# Altium schematic sheet Schematic.SchDoc
size A2; SheetNumber: 1; SheetTotal: 1
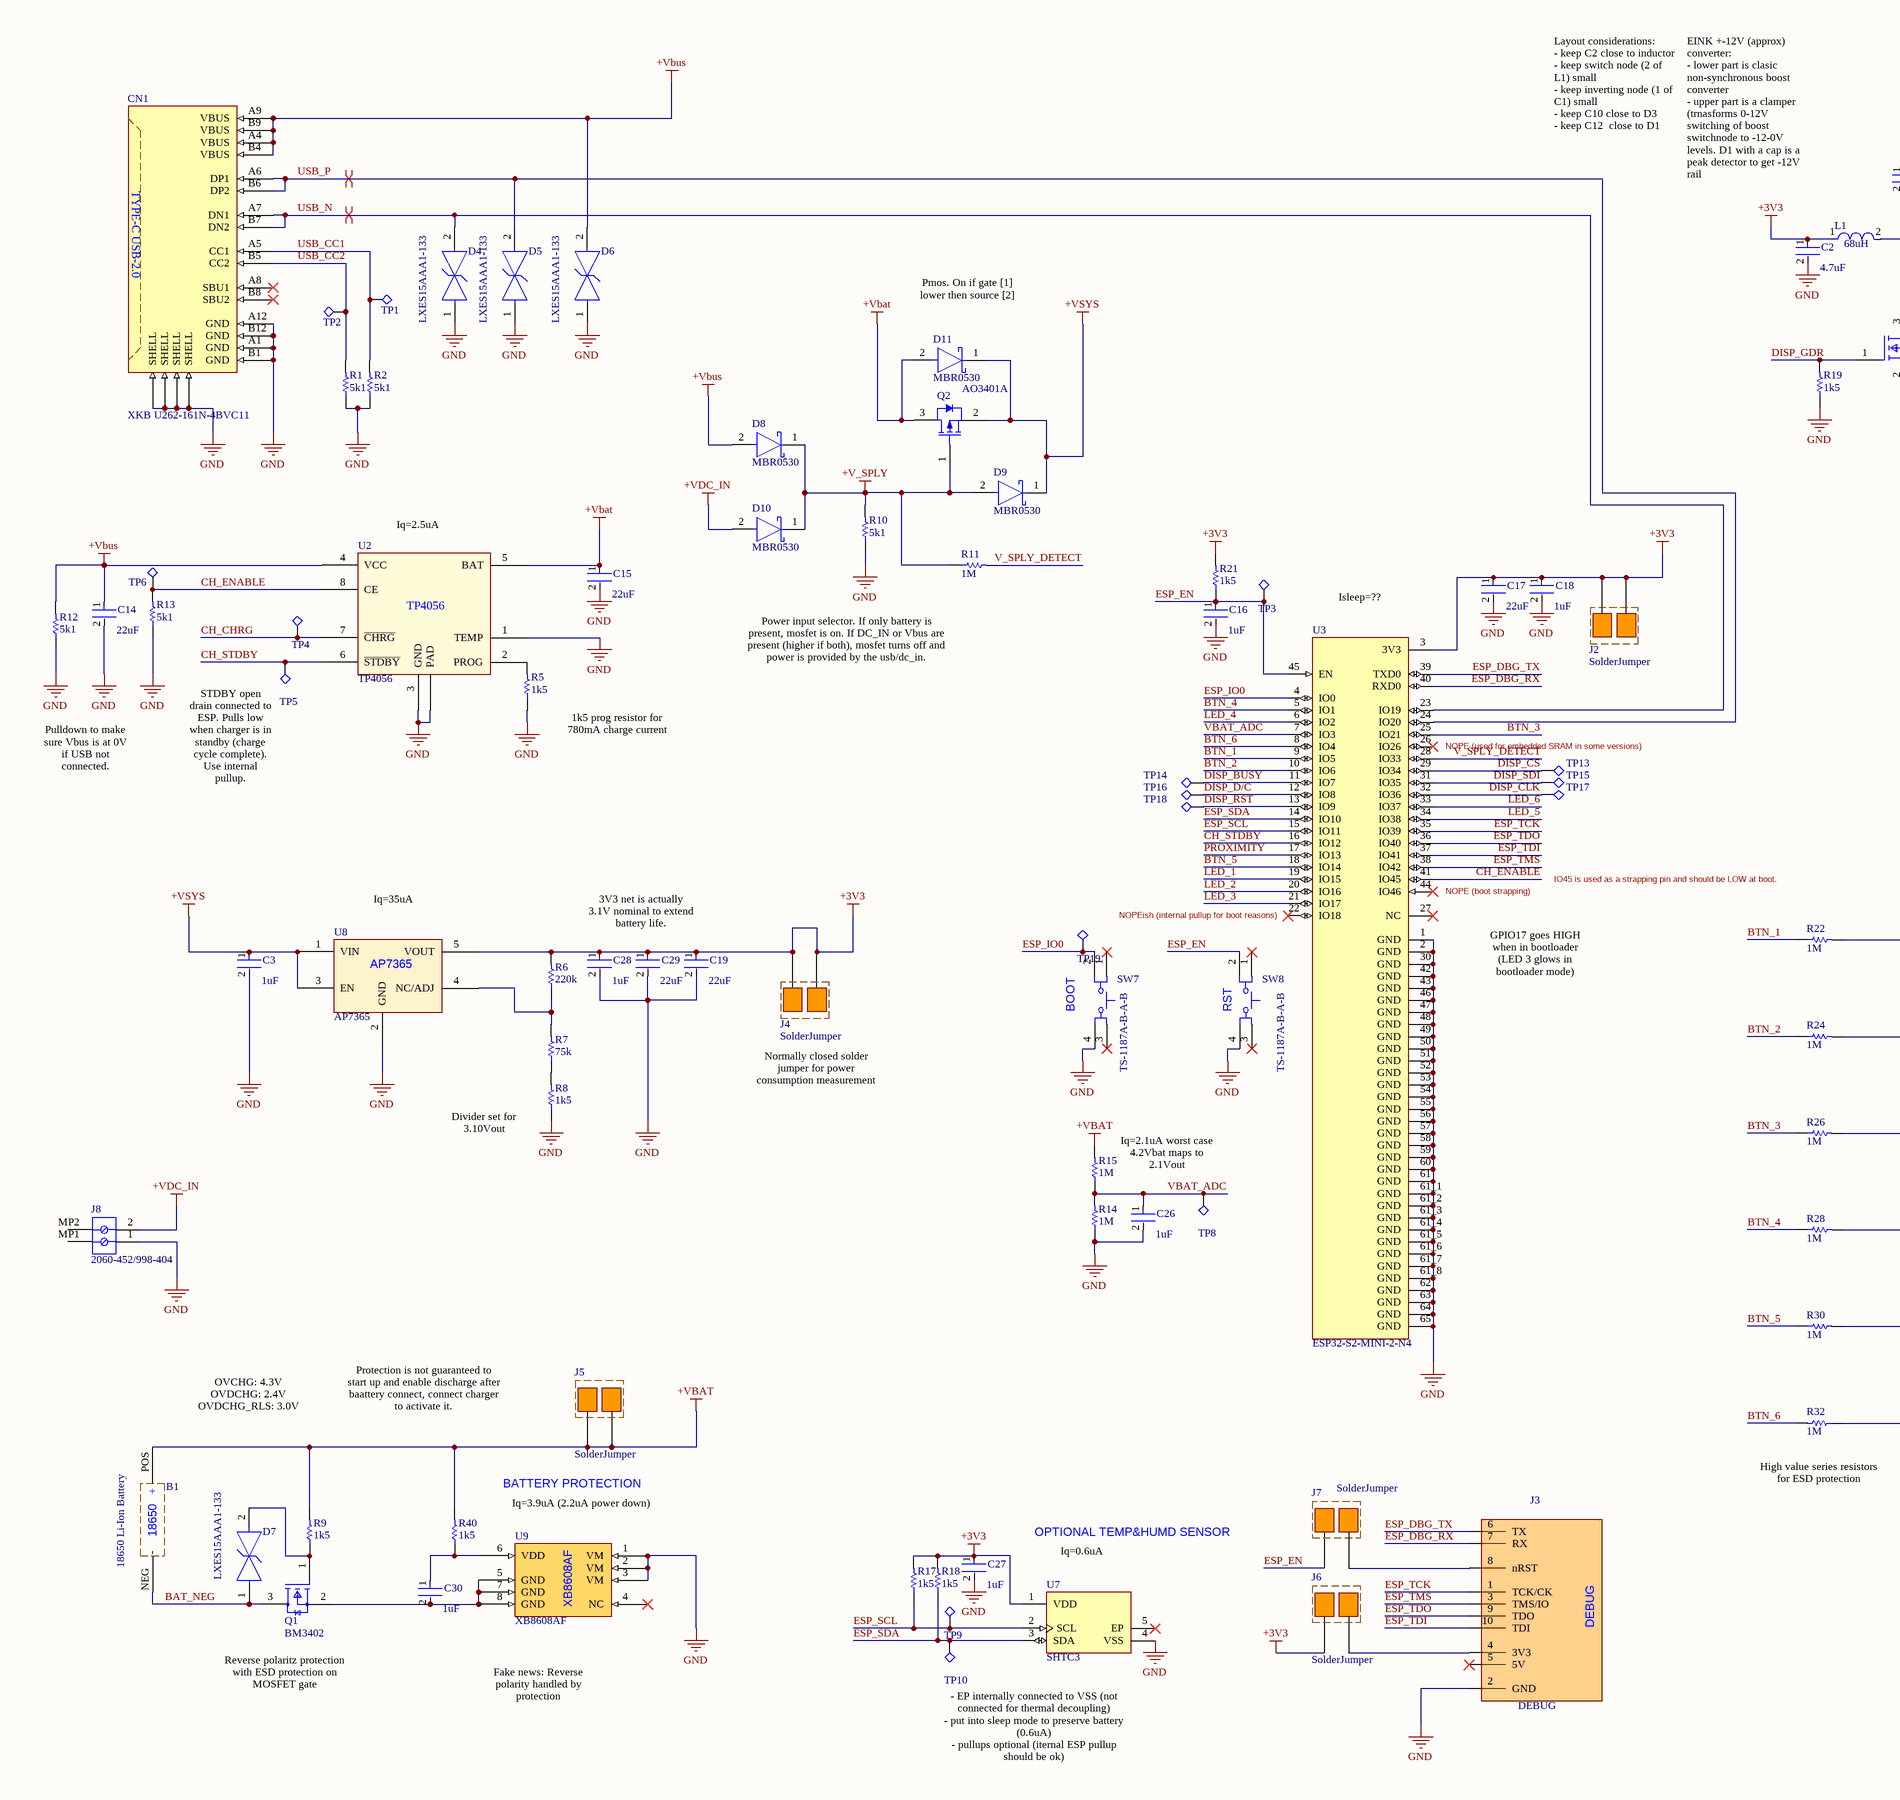
[diagram p0: Schematic.SchDoc, left]
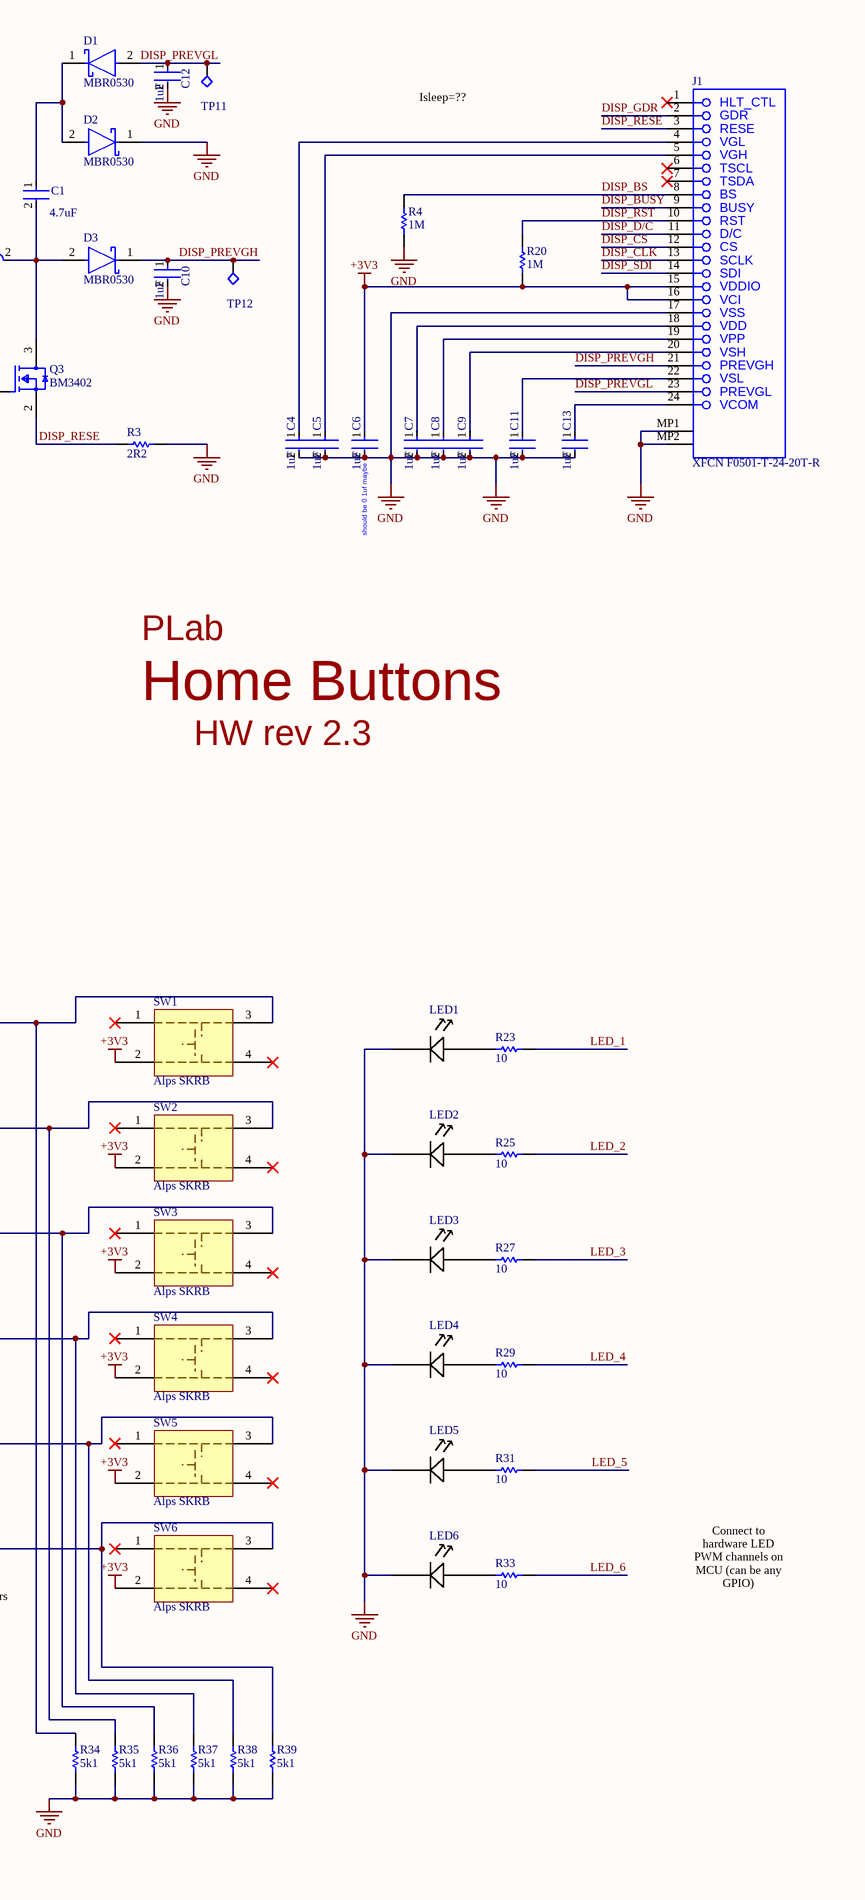
[diagram p1: Schematic.SchDoc, right]

## Parts
B1  18650 Li-Ion Battery  [18650 SMD holder]
C1  Capacitance: 4.7uF  [FP-CL21-IPC_A]  (hidden comment: CL21A475KAQNNNE)
C2  Capacitance: 4.7uF  [FP-CL21-IPC_A]  (hidden comment: CL21A475KAQNNNE)
C3  value 1uF  [FP-CL10B105KO8NNNC-IPC_B]  (hidden comment: CL10A105KB8NNNC)
C4  value 1uF  [FP-CL10B105KO8NNNC-IPC_B]  (hidden comment: CL10A105KB8NNNC)
C5  value 1uF  [FP-CL10B105KO8NNNC-IPC_B]  (hidden comment: CL10A105KB8NNNC)
C6  value 1uF  [FP-CL10B105KO8NNNC-IPC_B]  (hidden comment: CL10A105KB8NNNC)
C7  value 1uF  [FP-CL10B105KO8NNNC-IPC_B]  (hidden comment: CL10A105KB8NNNC)
C8  value 1uF  [FP-CL10B105KO8NNNC-IPC_B]  (hidden comment: CL10A105KB8NNNC)
C9  value 1uF  [FP-CL10B105KO8NNNC-IPC_B]  (hidden comment: CL10A105KB8NNNC)
C10  value 1uF  [FP-CL10B105KO8NNNC-IPC_B]  (hidden comment: CL10A105KB8NNNC)
C11  value 1uF  [FP-CL10B105KO8NNNC-IPC_B]  (hidden comment: CL10A105KB8NNNC)
C12  value 1uF  [FP-CL10B105KO8NNNC-IPC_B]  (hidden comment: CL10A105KB8NNNC)
C13  value 1uF  [FP-CL10B105KO8NNNC-IPC_B]  (hidden comment: CL10A105KB8NNNC)
C14  Capacitance: 22uF  [FP-CL31-IPC_B]  (hidden comment: CL31A226KPHNNNE)
C15  Capacitance: 22uF  [FP-CL31-IPC_B]  (hidden comment: CL31A226KPHNNNE)
C16  value 1uF  [FP-CL10B105KO8NNNC-IPC_B]  (hidden comment: CL10A105KB8NNNC)
C17  Capacitance: 22uF  [FP-CL31-IPC_B]  (hidden comment: CL31A226KPHNNNE)
C18  value 1uF  [FP-CL10B105KO8NNNC-IPC_B]  (hidden comment: CL10A105KB8NNNC)
C19  Capacitance: 22uF  [FP-CL31-IPC_B]  (hidden comment: CL31A226KPHNNNE)
C26  value 1uF  [FP-CL10B105KO8NNNC-IPC_B]  (hidden comment: CL10A105KB8NNNC)
C27  value 1uF  [FP-CL10B105KO8NNNC-IPC_B]  (hidden comment: CL10A105KB8NNNC)
C28  value 1uF  [FP-CL10B105KO8NNNC-IPC_B]  (hidden comment: CL10A105KB8NNNC)
C29  Capacitance: 22uF  [FP-CL31-IPC_B]  (hidden comment: CL31A226KPHNNNE)
C30  value 1uF  [FP-CL10B105KO8NNNC-IPC_B]  (hidden comment: CL10A105KB8NNNC)
CN1  XKB U262-161N-4BVC11  [XKB U262-161N-4BVC11]
D1  MBR0530  [FP-425-04-IPC_B]
D2  MBR0530  [FP-425-04-IPC_B]
D3  MBR0530  [FP-425-04-IPC_B]
D4  LXES15AAA1-133  [FP-LXES15-IPC_A]
D5  LXES15AAA1-133  [FP-LXES15-IPC_A]
D6  LXES15AAA1-133  [FP-LXES15-IPC_A]
D7  LXES15AAA1-133  [FP-LXES15-IPC_A]
D8  MBR0530  [FP-425-04-IPC_B]
D9  MBR0530  [FP-425-04-IPC_B]
D10  MBR0530  [FP-425-04-IPC_B]
D11  MBR0530  [FP-425-04-IPC_B]
J1  XFCN F0501-T-24-20T-R  [XFCN F0501-T-24-20T-R]
J2  SolderJumper  [SolderJumper_1mm]
J3  DEBUG  [muselab cmsis-dap frictionfit]
J4  SolderJumper  [SolderJumper_1mm]
J5  SolderJumper  [SolderJumper_1mm]
J6  SolderJumper  [SolderJumper_1mm]
J7  SolderJumper  [SolderJumper_1mm]
J8  2060-452/998-404  [WAGO-2060-452_V]
L1  value 68uH  [FP-DFE322512C-IPC_B]  (hidden comment: CMI322513J680MT)
LED1  Everlight Elec 23-21B/T1D-CP2Q2TY/2A  [Everlight Elec 23-21B/T1D-CP2Q2TY/2A]  (value not drawn)
LED2  Everlight Elec 23-21B/T1D-CP2Q2TY/2A  [Everlight Elec 23-21B/T1D-CP2Q2TY/2A]  (value not drawn)
LED3  Everlight Elec 23-21B/T1D-CP2Q2TY/2A  [Everlight Elec 23-21B/T1D-CP2Q2TY/2A]  (value not drawn)
LED4  Everlight Elec 23-21B/T1D-CP2Q2TY/2A  [Everlight Elec 23-21B/T1D-CP2Q2TY/2A]  (value not drawn)
LED5  Everlight Elec 23-21B/T1D-CP2Q2TY/2A  [Everlight Elec 23-21B/T1D-CP2Q2TY/2A]  (value not drawn)
LED6  Everlight Elec 23-21B/T1D-CP2Q2TY/2A  [Everlight Elec 23-21B/T1D-CP2Q2TY/2A]  (value not drawn)
Q1  BM3402  [FP-SOT23-IPC_B]
Q2  AO3401A  [AO-SOT-23-3L_V]
Q3  BM3402  [FP-SOT23-IPC_B]
R1  value 5k1  [RESC1608X55X30NL15T15]  (hidden comment: 0603WAF5101T5E)
R2  value 5k1  [RESC1608X55X30NL15T15]  (hidden comment: 0603WAF5101T5E)
R3  value 2R2  [RESC1608X55X30ML15T15]  (hidden comment: 0603WAF220KT5E)
R4  value 1M  [RESC1608X55X30NL15T15]  (hidden comment: 0603WAF1004T5E)
R5  value 1k5  [RESC1608X55X30NL15T15]  (hidden comment: 0603WAF1501T5E)
R6  value 220k  [RESC1608X55X30NL15T15]  (hidden comment: 0603WAF2203T5E)
R7  value 75k  [RESC1608X55X30NL15T15]  (hidden comment: 0603WAF7502T5E)
R8  value 1k5  [RESC1608X55X30NL15T15]  (hidden comment: 0603WAF1501T5E)
R9  value 1k5  [RESC1608X55X30NL15T15]  (hidden comment: 0603WAF1501T5E)
R10  value 5k1  [RESC1608X55X30NL15T15]  (hidden comment: 0603WAF5101T5E)
R11  value 1M  [RESC1608X55X30NL15T15]  (hidden comment: 0603WAF1004T5E)
R12  value 5k1  [RESC1608X55X30NL15T15]  (hidden comment: 0603WAF5101T5E)
R13  value 5k1  [RESC1608X55X30NL15T15]  (hidden comment: 0603WAF5101T5E)
R14  value 1M  [RESC1608X55X30NL15T15]  (hidden comment: 0603WAF1004T5E)
R15  value 1M  [RESC1608X55X30NL15T15]  (hidden comment: 0603WAF1004T5E)
R17  value 1k5  [RESC1608X55X30NL15T15]  (hidden comment: 0603WAF1501T5E)
R18  value 1k5  [RESC1608X55X30NL15T15]  (hidden comment: 0603WAF1501T5E)
R19  value 1k5  [RESC1608X55X30NL15T15]  (hidden comment: 0603WAF1501T5E)
R20  value 1M  [RESC1608X55X30NL15T15]  (hidden comment: 0603WAF1004T5E)
R21  value 1k5  [RESC1608X55X30NL15T15]  (hidden comment: 0603WAF1501T5E)
R22  value 1M  [RESC1608X55X30NL15T15]  (hidden comment: 0603WAF1004T5E)
R23  value 10  [RESC1608X55X30NL15T15]  (hidden comment: 0603WAF100JT5E)
R24  value 1M  [RESC1608X55X30NL15T15]  (hidden comment: 0603WAF1004T5E)
R25  value 10  [RESC1608X55X30NL15T15]  (hidden comment: 0603WAF100JT5E)
R26  value 1M  [RESC1608X55X30NL15T15]  (hidden comment: 0603WAF1004T5E)
R27  value 10  [RESC1608X55X30NL15T15]  (hidden comment: 0603WAF100JT5E)
R28  value 1M  [RESC1608X55X30NL15T15]  (hidden comment: 0603WAF1004T5E)
R29  value 10  [RESC1608X55X30NL15T15]  (hidden comment: 0603WAF100JT5E)
R30  value 1M  [RESC1608X55X30NL15T15]  (hidden comment: 0603WAF1004T5E)
R31  value 10  [RESC1608X55X30NL15T15]  (hidden comment: 0603WAF100JT5E)
R32  value 1M  [RESC1608X55X30NL15T15]  (hidden comment: 0603WAF1004T5E)
R33  value 10  [RESC1608X55X30NL15T15]  (hidden comment: 0603WAF100JT5E)
R34  value 5k1  [RESC1608X55X30NL15T15]  (hidden comment: 0603WAF5101T5E)
R35  value 5k1  [RESC1608X55X30NL15T15]  (hidden comment: 0603WAF5101T5E)
R36  value 5k1  [RESC1608X55X30NL15T15]  (hidden comment: 0603WAF5101T5E)
R37  value 5k1  [RESC1608X55X30NL15T15]  (hidden comment: 0603WAF5101T5E)
R38  value 5k1  [RESC1608X55X30NL15T15]  (hidden comment: 0603WAF5101T5E)
R39  value 5k1  [RESC1608X55X30NL15T15]  (hidden comment: 0603WAF5101T5E)
R40  value 1k5  [RESC1608X55X30NL15T15]  (hidden comment: 0603WAF1501T5E)
SW1  Alps SKRB  [Alps SKRB]
SW2  Alps SKRB  [Alps SKRB]
SW3  Alps SKRB  [Alps SKRB]
SW4  Alps SKRB  [Alps SKRB]
SW5  Alps SKRB  [Alps SKRB]
SW6  Alps SKRB  [Alps SKRB]
SW7  TS-1187A-B-A-B  [ESWI-TL3342F160QG_V]
SW8  TS-1187A-B-A-B  [ESWI-TL3342F160QG_V]
TP1  test point 1.5mm  [TP1_FULL]  (value not drawn)
TP2  test point 1.5mm  [TP1_FULL]  (value not drawn)
TP3  test point 1.5mm  [TP1_FULL]  (value not drawn)
TP4  test point 1.5mm  [TP1_FULL]  (value not drawn)
TP5  test point 1.5mm  [TP1_FULL]  (value not drawn)
TP6  test point 1.5mm  [TP1_FULL]  (value not drawn)
TP8  test point 1.5mm  [TP1_FULL]  (value not drawn)
TP9  test point 1.5mm  [TP1_FULL]  (value not drawn)
TP10  test point 1.5mm  [TP1_FULL]  (value not drawn)
TP11  test point 1.5mm  [TP1_FULL]  (value not drawn)
TP12  test point 1.5mm  [TP1_FULL]  (value not drawn)
TP13  test point 1.5mm  [TP1_FULL]  (value not drawn)
TP14  test point 1.5mm  [TP1_FULL]  (value not drawn)
TP15  test point 1.5mm  [TP1_FULL]  (value not drawn)
TP16  test point 1.5mm  [TP1_FULL]  (value not drawn)
TP17  test point 1.5mm  [TP1_FULL]  (value not drawn)
TP18  test point 1.5mm  [TP1_FULL]  (value not drawn)
TP19  test point 1.5mm  [TP1_FULL]  (value not drawn)
U2  TP4056  [Generic SOP8-PP]
U3  ESP32-S2-MINI-2-N4  [XCVR_ESP32-S2-MINI-1]
U7  SHTC3  [FP-SHTC3-MFG]
U8  AP7365  [Diodes Inc SOT25]
U9  XB8608AF  [generic sop8]

## Nets
+3V3: C2.1 C6.1 C17.1 C18.1 C19.1 C27.1 C28.1 C29.1 J1.15 J1.16 J2.1 J2.2 J4.1 J4.2 J6.1 L1.1 R6.2 R17.2 R18.2 R20.1 R21.2 SW1.2 SW2.2 SW3.2 SW4.2 SW5.2 SW6.2 U3.3(3V3) U7.1(VDD) U8.5(VOUT)
+V_SPLY: D8.1(C) D9.2(A) D10.1(C) Q2.1(GATE) R10.2 R11.1
+Vbat: B1.POS C15.1 D11.2(A) J5.1 J5.2 Q2.3(DRAIN) R9.2 R15.2 R40.2 U2.5(BAT)
+Vbus: C14.1 CN1.A4(VBUS) CN1.A9(VBUS) CN1.B4(VBUS) CN1.B9(VBUS) D6.2 D8.2(A) R12.2 U2.4(VCC)
+VDC_IN: D10.2(A) J8.2
+VSYS: C3.1 D9.1(C) D11.1(C) Q2.2(SOURCE) U8.1(VIN) U8.3(EN)
GND: C2.2 C3.2 C4.2 C5.2 C6.2 C7.2 C8.2 C9.2 C10.2 C11.2 C12.2 C13.2 C14.2 C15.2 C16.2 C17.2 C18.2 C19.2 C26.2 C27.2 C28.2 C29.2 CN1.A1(GND) CN1.A12(GND) CN1.B1(GND) CN1.B12(GND) CN1.SHELL1(SHELL) CN1.SHELL2(SHELL) CN1.SHELL3(SHELL) CN1.SHELL4(SHELL) D2.1(C) D4.1 D5.1 D6.1 J1.17 J1.MP1 J1.MP2 J3.2(GND) J8.1 LED1.2(NEG) LED2.2(NEG) LED3.2(NEG) LED4.2(NEG) LED5.2(NEG) LED6.2(NEG) R1.1 R2.1 R3.2 R4.1 R5.1 R8.1 R10.1 R12.1 R13.1 R14.1 R19.1 R34.1 R35.1 R36.1 R37.1 R38.1 R39.1 SW7.4 SW8.4 U2.1(TEMP) U2.3(GND) U2.9(PAD) U3.1(GND) U3.2(GND) U3.30(GND) U3.42(GND) U3.43(GND) U3.46(GND) U3.47(GND) U3.48(GND) U3.49(GND) U3.50(GND) U3.51(GND) U3.52(GND) U3.53(GND) U3.54(GND) U3.55(GND) U3.56(GND) U3.57(GND) U3.58(GND) U3.59(GND) U3.60(GND) U3.61(GND) U3.61_1(GND) U3.61_2(GND) U3.61_3(GND) U3.61_4(GND) U3.61_5(GND) U3.61_6(GND) U3.61_7(GND) U3.61_8(GND) U3.62(GND) U3.63(GND) U3.64(GND) U3.65(GND) U7.4(VSS) U8.2(GND) U9.1(VM) U9.2(VM) U9.3(VM)
BAT_NEG: B1.NEG D7.1 Q1.3(D)
BTN_1: R22.1 U3.9(IO5)
BTN_2: R24.1 U3.10(IO6)
BTN_3: R26.1 U3.25(IO21)
BTN_4: R28.1 U3.5(IO1)
BTN_5: R30.1 U3.18(IO14)
BTN_6: R32.2 U3.8(IO4)
CH_CHRG: TP4.1 U2.7(~{CHRG})
CH_ENABLE: R13.2 TP6.1 U2.8(CE) U3.41(IO45)
CH_STDBY: TP5.1 U2.6(~{STDBY}) U3.16(IO12)
DISP_BS: J1.8 R4.2
DISP_BUSY: J1.9 TP14.1 U3.11(IO7)
DISP_CLK: J1.13 TP17.1 U3.32(IO36)
DISP_CS: J1.12 TP13.1 U3.29(IO34)
DISP_D/C: J1.11 TP16.1 U3.12(IO8)
DISP_GDR: J1.2 Q3.1(G) R19.2
DISP_PREVGH: C10.1 D3.1(C) J1.21 TP12.1
DISP_PREVGL: C12.1 D1.2(A) J1.23 TP11.1
DISP_RESE: J1.3 Q3.2(S) R3.1
DISP_RST: J1.10 R20.2 TP18.1 U3.13(IO9)
DISP_SDI: J1.14 TP15.1 U3.31(IO35)
ESP_DBG_RX: J3.7(RX) U3.40(RXD0)
ESP_DBG_TX: J3.6(TX) U3.39(TXD0)
ESP_EN: C16.1 J7.1 R21.1 SW8.2 TP3.1 U3.45(EN)
ESP_IO0: SW7.2 TP19.1 U3.4(IO0)
ESP_SCL: R17.1 TP9.1 U3.15(IO11) U7.2(SCL)
ESP_SDA: R18.1 TP10.1 U3.14(IO10) U7.3(SDA)
ESP_TCK: J3.1(TCK/CK) U3.35(IO39)
ESP_TDI: J3.10(TDI) U3.37(IO41)
ESP_TDO: J3.9(TDO) U3.36(IO40)
ESP_TMS: J3.3(TMS/IO) U3.38(IO42)
LED_1: R23.1 U3.19(IO15)
LED_2: R25.1 U3.20(IO16)
LED_3: R27.1 U3.21(IO17)
LED_4: R29.1 U3.6(IO2)
LED_5: R31.1 U3.34(IO38)
LED_6: R33.1 U3.33(IO37)
PROXIMITY: U3.17(IO13)
USB_CC1: CN1.A5(CC1) R2.2 TP1.1
USB_CC2: CN1.B5(CC2) R1.2 TP2.1
USB_N: CN1.A7(DN1) CN1.B7(DN2) D4.2 U3.23(IO19)
USB_P: CN1.A6(DP1) CN1.B6(DP2) D5.2 U3.24(IO20)
V_SPLY_DETECT: R11.2 U3.28(IO33)
VBAT_ADC: C26.1 R14.2 R15.1 TP8.1 U3.7(IO3)
NetC1_1: C1.1 D1.1(C) D2.2(A)
NetC1_2: C1.2 D3.2(A) L1.2 Q3.3(D)
NetC4_1: C4.1 J1.4
NetC5_1: C5.1 J1.5
NetC7_1: C7.1 J1.18
NetC8_1: C8.1 J1.19
NetC9_1: C9.1 J1.20
NetC11_1: C11.1 J1.22
NetC13_1: C13.1 J1.24
NetC30_1: C30.1 R40.1 U9.6(VDD)
NetC30_2: C30.2 Q1.2(S) U9.5(GND) U9.7(GND) U9.8(GND)
NetD7_2: D7.2 Q1.1(G) R9.1
NetJ3_4: J3.4(3V3) J6.2
NetJ3_8: J3.8(nRST) J7.2
NetLED1_1: LED1.1(POS) R23.2
NetLED2_1: LED2.1(POS) R25.2
NetLED3_1: LED3.1(POS) R27.2
NetLED4_1: LED4.1(POS) R29.2
NetLED5_1: LED5.1(POS) R31.2
NetLED6_1: LED6.1(POS) R33.2
NetR5_2: R5.2 U2.2(PROG)
NetR6_1: R6.1 R7.2 U8.4(NC/ADJ)
NetR7_1: R7.1 R8.2
NetR22_2: R22.2 R34.2 SW1.3
NetR24_2: R24.2 R35.2 SW2.3
NetR26_2: R26.2 R36.2 SW3.3
NetR28_2: R28.2 R37.2 SW4.3
NetR30_2: R30.2 R38.2 SW5.3
NetR32_1: R32.1 R39.2 SW6.3

Not connected (* = marked no-connect by the designer): CN1 A8(SBU1)* B8(SBU2)*; J1 1* 6* 7*; J3 5(5V)*; J8 MP1 MP2; SW1 1* 4*; SW2 1* 4*; SW3 1* 4*; SW4 1* 4*; SW5 1* 4*; SW6 1* 4*; SW7 1* 3*; SW8 1* 3*; U3 22(IO18)* 26(IO26)* 27(NC)* 44(IO46)*; U7 5(EP)*; U9 4(NC)*

## Layout directives
differential pair: USB_N, USB_P

## Notes on the sheet
- Layout considerations:
  - keep C2 close to inductor
  - keep switch node (2 of L1) small
  - keep inverting node (1 of C1) small
  - keep C10 close to D3
  - keep C12  close to D1
- Isleep=??
- EINK +-12V (approx) converter:
  - lower part is clasic non-synchronous boost converter
  - upper part is a clamper (trnasforms 0-12V switching of boost switchnode to -12-0V levels. D1 with a cap is a peak detector to get -12V rail
- Pmos. On if gate [1] lower then source [2]
- (near C6) should be 0.1uf maybe
- (near U2) Iq=2.5uA
- (near U3) Isleep=??
- Home Buttons
- PLab
- Power input selector. If only battery is present, mosfet is on. If DC_IN or Vbus are present (higher if both), mosfet turns off and power is provided by the usb/dc_in.
- HW rev 2.3
- (near R5) 1k5 prog resistor for 780mA charge current
- NOPE (used for embedded SRAM in some versions)
- Pulldown to make sure Vbus is at 0V if USB not connected.
- (near TP5) STDBY open drain connected to ESP. Pulls low when charger is in standby (charge cycle complete). Use internal pullup.
- (near U8) Iq=35uA
- 3V3 net is actually 3.1V nominal to extend battery life.
- (near U3) NOPEish (internal pullup for boot reasons)
- (near U3) NOPE (boot strapping)
- IO45 is used as a strapping pin and should be LOW at boot.
- GPIO17 goes HIGH when in bootloader (LED 3 glows in bootloader mode)
- (near SW7) BOOT
- (near SW8) RST
- Normally closed solder jumper for power consumption measurement
- (near R8) Divider set for 3.10Vout
- Iq=2.1uA worst case
  4.2Vbat maps to 2.1Vout
- OVCHG: 4.3V
  OVDCHG: 2.4V
  OVDCHG_RLS: 3.0V
  OVRCRNT: 9A
- Protection is not guaranteed to start up and enable discharge after baattery connect, connect charger to activate it.
- Connect to hardware LED PWM channels on MCU (can be any GPIO)
- BATTERY PROTECTION
- Iq=3.9uA (2.2uA power down)
- OPTIONAL TEMP&HUMD SENSOR
- (near R32) High value series resistors for ESD protection
- (near U7) Iq=0.6uA
- Reverse polaritz protection with ESD protection on MOSFET gate
- Fake news: Reverse polarity handled by protection
- - EP internally connected to VSS (not connected for thermal decoupling)
  - put into sleep mode to preserve battery (0.6uA)
  - pullups optional (iternal ESP pullup should be ok)
- (in symbol 18650 Li-Ion Battery) +; 18650; -
- (in symbol XFCN F0501-T-24-20T-R) HLT_CTL; GDR; RESE; VGL; VGH; TSCL; TSDA; BS; BUSY; RST; D/C; CS; SCLK; SDI; VDDIO; VCI; VSS; VDD; VPP; VSH; PREVGH; VSL; PREVGL; VCOM
- (in symbol XKB U262-161N-4BVC11) TYPE-C USB-2.0

## Library data of the parts
B1 = 18650 Li-Ion Battery: Lithium 18650 battery cell
C1 C2 = CMP-13271-002624-1: CL21 Series 0805 4.7uF 25V ±10% Tolerance X5R Multilayer Ceramic Chip Capacitor; Case Code (Imperial): 0805; Thickness: 0.055inch; Mount: Surface Mount; Case Code (Metric): 2012; Depth: 1.25mm; Lead Free: Lead Free; Case/Package: 0805; Voltage Rating: 25V; Package Quantity: 1; Width: 0.049inch; Radiation Hardening: No; Voltage Rating (DC): 25V; Length: 2mm; Dielectric: X5R; Height: 1.25mm; Packaging: Tape and Reel; Tolerance: 10%; Min Operating Temperature: -55°C; Max Operating Temperature: 85°C; LCSC: C1779
C3-C13 C16 C18 C26-C28 C30 = CMP-2000-06093-2: CAP CER 1UF 50V X5R 0603; Manufacturer: Samsung Electro-Mechanics America, Inc; Manufacturer Part Number: CL10B105KO8NNNC; Temperature Coefficient: 15%; Material: Ceramic; Tolerance: 10%; Voltage Rating: 50V; Automotive: No; ComponentLink2Description: Datasheet; Device Class L3: Ceramic Capacitors; Capacitance: 1uF; Temperature Characteristic: X5R; Temperature Range High: +125°C; Digikey Description: CAP CER 1UF 16V X7R 0603; Device Class L2: Capacitors; Octopart: https://octopart.com/cl10b105ko8nnnc-samsung-19018973; ComponentLink2URL: http://www.samsungsem.com/global/front/downloadcms.do?path=%2F%2Fglobal%2F%2Fsupport%2F%2Fproduct-search%2F%2Fmlcc%2F%2F__icsFiles%2F%2Fafieldfile%2F%2F2019%2F%2F06%2F%2F18&fileName=CL10B105KO8NNNC-19.pdf; Lead Free: Yes; Height: 0.9mm; Package: CL10B105KO8NNNC; Temperature Range Low: -55°C; Device Class L1: Passive Components; RoHS: TRUE; Temperature: -55°C to +125°C; Category: Cap; Ipc Land Pattern Name: CAPC16080X80; LCSC: C15849
C14 C15 C17 C19 C29 = CMP-13271-002604-1: Cap Ceramic 22uF 10V X5R ±10% SMD 1206; Package Quantity: 1; Radiation Hardening: No; Thickness: 0.071inch; Case Code (Metric): 3216; Height: 1.6mm; Min Operating Temperature: -55°C; Width: 0.063inch; Mount: Surface Mount; Packaging: Tape and Reel; Depth: 1.6mm; Max Operating Temperature: 85°C; Dielectric: X5R; Case/Package: 1206; Lead Free: Lead Free; Tolerance: 10%; Case Code (Imperial): 1206; Length: 3.2mm; Voltage Rating (DC): 10V; Voltage Rating: 10V; LCSC: C5672
CN1 = XKB U262-161N-4BVC11: USB Type-C connector, USB-2.0, 16 pins; LCSC: C319148
D1-D3 D8-D11 = CMP-2000-05113-2: DIODE SCHOTTKY 30V 500MA SOD123; Polarity: Standard; Max Reverse Leakage Current: 130uA; Forward Voltage: 430mV; Element Configuration: Single; Peak Non-Repetitive Surge Current: 5.5A; REACH SVHC: No SVHC; Contact Plating: Tin; Width: 1.6mm; Weight: 0.03g; Max Reverse Voltage (DC): 30V; Mount: Surface Mount; Max Repetitive Reverse Voltage (Vrrm): 30V; Number of Pins: 2; Height: 1.03mm; Current Rating: 500mA; Max Forward Surge Current (Ifsm): 5.5A; Lead Free: Lead Free; Max Surge Current: 5.5A; Peak Reverse Current: 130uA; Min Operating Temperature: -65°C; Radiation Hardening: No; Max Operating Temperature: 150°C; Average Rectified Current: 500mA; Packaging: Tape and Reel; Length: 2.7mm; Forward Current: 500mA; Voltage Rating (DC): 30V; Package Quantity: 1; Output Current: 500mA; LCSC: C77336
D4-D7 = CMP-06195-000011-1: TVS DIODE 15V 1005; Number of Bidirectional Channels: 1; Power Line Protection: No; Mount: Surface Mount; Case Code (Metric): 1005; Min Operating Temperature: -40°C; Case Code (Imperial): 0402; Resistor Type: Zener; Reverse Standoff Voltage: 15V; Case/Package: 0402; Packaging: Tape and Reel; Max Operating Temperature: 85°C; LCSC: C191267
J1 = XFCN F0501-T-24-20T-R: XFCN F0501-T-24-20T-R 0.5mm fpc top contacts, slide retentioner; LCSC: C840496
J3 = MuseLab CMSIS-DAP probe receiving connector
J8 = CMP-2000-05527-1: Terminal Block, Pitch 4 mm, 1 x 2 Position, Height 4.5 mm, -60 to 105 degC, RoHS, Tape and Reel; Manufacturer: WAGO; Number of contacts: 2; Content: 1pc(s); Min. cross section (flexible): 0.25mm²; Stripping length: 6-7mm; Nominal current: 9A; Nominal voltage: 160V; Pitch: 4mm; Min. cross section (unflexible): 0.2mm²; Max. cross section (inflexible): 0.75mm²; AWG: 24-18; Connection: Pullspring; Type: 2060-452/998-404; Package Reference: 2060-452; Mounting Technology: SurfaceMount; Colour: White; Package Description: Terminal Block, Pitch 4 mm, 1 x 2 Position, Height 4.5 mm; Height: 4.5mm; Manufacturer URL: http://global.wago.com/en/index-en.jsp; Material: PPA-GFenclosure·Tin-platedcoppercontacts; Width: 10.1mm; Manufacturer part No.: 2060-452/998-404; Datasheet URL: http://www.wago.com/infomaterial/pdf/60255126.pdf; Contact material: Tinplated; Length: 7.9mm; Max. cross section (flexible): 0.75mm²; Datasheet Version: 03/2015
L1 = CMP-06042-000782-1: CMI322513J680MT 1210 chip SMD inductor 68uH; LCSC: C401470
LED1-LED6 = Everlight Elec 23-21B/T1D-CP2Q2TY/2A: reverse mount SMD led, cool white; LCSC: C414638
Q1 Q3 = CMP-83955-000006-1: BORN BM3402 MOSFET N-CH 30V 5.1A SOT23; LCSC: C431498
Q2 = CMP-2000-05778-1: P-Channel MOSFET, 30 V, 4 A, -55 to 150 degC, 3-Pin SOT-23-3L, RoHS, Tape and Reel; Manufacturer: Alpha and Omega; Output Power (Max): NotRequiredW; Power Dissipation: 1.4W; Rad Hardened: No; Drain Efficiency: NotRequired%; Drain-Source On-Volt: 30V; Noise Figure: NotRequireddB; Frequency (Max): NotRequiredMHz; Number of  Elements: 1; Gate-Source Voltage (Max): ?12V; Drain Current (Max): 4A; Channel Mode: Enhancement; Drain-Source On-Res: 0.044ohm; Type: PowerMOSFET; Polarity: P; Package URL: http://www.aosmd.com/res/packaging_information/SOT-23-3L.pdf; Datasheet URL: http://www.aosmd.com/res/data_sheets/AO3401A.pdf; Package Type: SOT-23; Package Description: 3-Pin Small Outline Transistor, Body 2.95 x 1.6 mm, Pitch 0.95 mm; Mounting: SurfaceMount; Manufacturer URL: http://www.aosmd.com/; Continuous Drain Current: 4A; Package Reference: SOT-23-3L; Mounting Technology: SurfaceMount; Operating Temperature Classification: Military; Power Gain: NotRequireddB; Datasheet Version: Rev. 3, 03/2011; Operating Temp Range: -55Cto150C; Pin Count: 3; LCSC: C15127
R1 R2 R6 R7 R10 R12 R13 R23 R25 R27 R29 R31 R33-R39 = CMP-2000-00540-1: Manufacturer: UNI_ROYAL
  R1 R2 R10 R12 R13 R34-R39: Part Number: 0603WAF5101T5E; LCSC: C23186
  R6: Part Number: 0603WAF2203T5E; LCSC: C22961
  R7: Part Number: 0603WAF7502T5E; LCSC: C23242
  R23 R25 R27 R29 R31 R33: Part Number: 0603WAF100JT5E; LCSC: C22859
R3 = CMP-2000-00787-1: Manufacturer: UNI-ROYAL; Part Number: 0603WAF220KT5E; LCSC: C22939
R4 R11 R14 R15 R20 R22 R24 R26 R28 R30 R32 = CMP-1012-00849-2: Manufacturer: Panasonic; Part Number: 0603WAF1004T5E; LCSC: C22935
R5 R8 R9 R17-R19 R21 R40 = CMP-2000-00540-1: Part Number: 0603WAF5101T5E; Manufacturer: UNI_ROYAL; LCSC: C22843
SW1-SW6 = Alps SKRB: SKRB series SMD tactile button Alps Alpine; Variant: SKRBAKE010; LCSC: C139790; ComponentLink1Description: Datasheet; ComponentLink1URL: https://tech.alpsalpine.com/prod/e/html/tact/surfacemount/skrb/skrbake010.html
SW7 SW8 = CMP-1696-00003-1: XKB TS-1187A-B-A-B C318884; LCSC: C318884
TP1-TP6 TP8-TP19 = Test Point: Test point ,1.5mm diameter, no hole; Category: testpoints
U2 = TP4056: 1s Lithium linear battery charger, 1A output; ComponentLink1Description: Datasheet; ComponentLink1URL: https://static.chipdip.ru/lib/977/DOC002977110.pdf; LCSC: C16581
U3 = ESP32-S2-MINI-1: WiFi 802.11b/g/n Transceiver Module 2.412GHz ~ 2.484GHz Antenna Not Included Surface Mount; MF: Espressif Systems; SnapEDA_Link: https://www.snapeda.com/parts/ESP32-S2-MINI-1/Espressif+Systems/view-part/?ref=snap; MP: ESP32-S2-MINI-1; Price: None; Package: NON STANDARD-65 Espressif Systems; Value: *; Check_prices: https://www.snapeda.com/parts/ESP32-S2-MINI-1/Espressif+Systems/view-part/?ref=eda; Purchase-URL: https://pricing.snapeda.com/search/part/ESP32-S2-MINI-1/?ref=eda; Availability: In Stock; LCSC: C3013906
U7 = CMP-144040-000003-1: SENSOR HUMI/TEMP I2C 2% SMD; Manufacturer: Sensirion; Operating Supply Current: 0.3-900uA; Resolution: 16bits; Min Supply Voltage: 1.62V; Max Supply Voltage: 3.6V; Category: IC; Device Class L3: unset; ComponentLink2URL: https://www.sensirion.com/fileadmin/user_upload/customers/sensirion/Dokumente/0_Datasheets/Humidity/Sensirion_Humidity_Sensors_SHTC3_Datasheet.pdf; Ipc Land Pattern Name: DFN200X200X75-4; RoHS: TRUE; Height: 0.75mm; Interface: I2C; Temperature Range High: +125°C; Accuracy: 2%; Sensor Output: I2C; Automotive: No; Package: 0; Device Class L1: Sensors; Manufacturer Part Number: SHTC3; Digikey Description: SENSOR HUMI/TEMP I2C 2% SMD; Lead Free: Yes; Temperature: -40°C to +125°C; Device Class L2: Temperature and Humidity Sensors; ComponentLink2Description: Datasheet; Octopart: https://octopart.com/shtc3-sensirion-91912225; Mouser Description: SHTC3 Series 0 to 100% RH 3.6 V Humidity and Temperature Sensor IC - DFN-4; Temperature Range Low: -40°C; LCSC: C2880044
U8 = AP7365: Diodes Inc AP7365 LDO, fast transient, 600mA
U9 = XB8608AF: XYSEMI 1s Li-Ion integrated protection IC; LCSC: C2681922